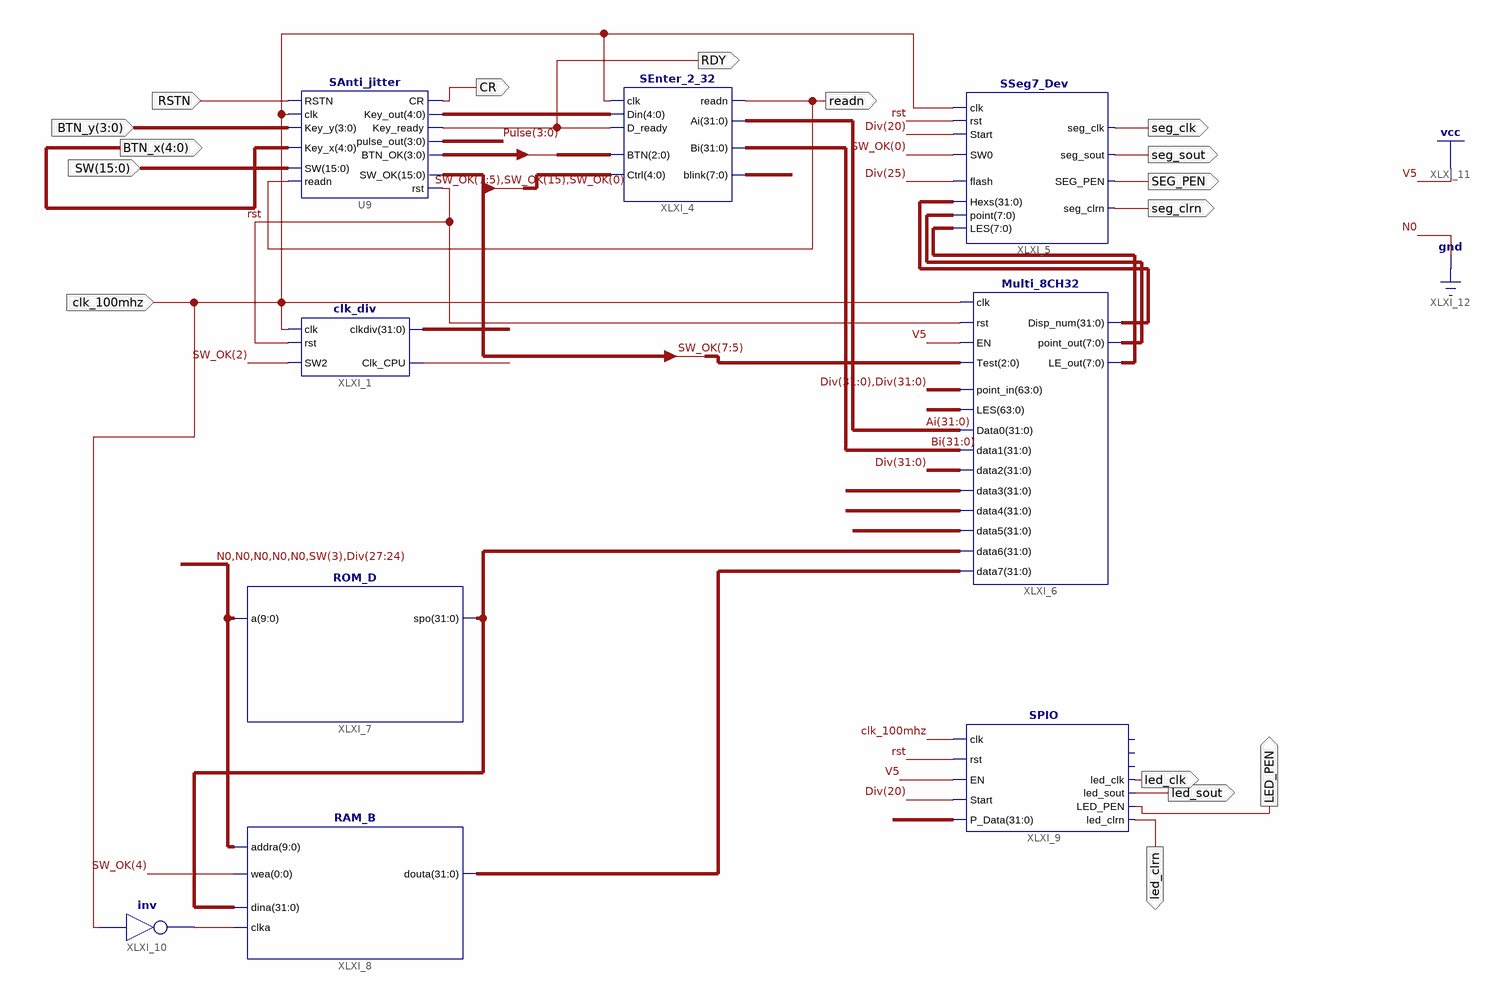
[diagram p0: schematic sheet 1]
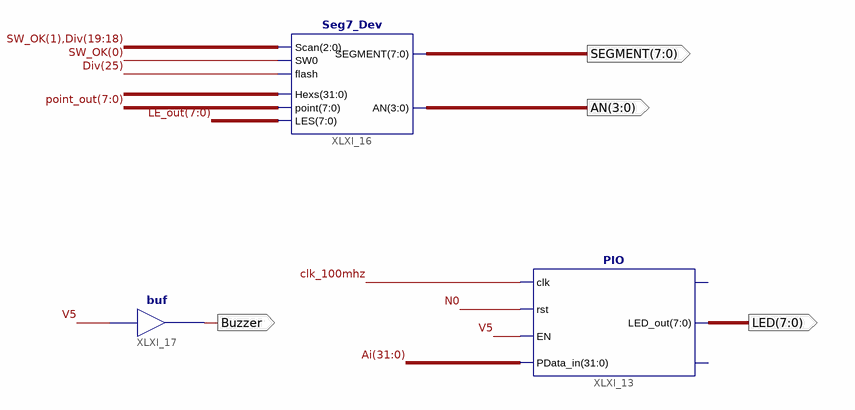
[diagram p1: schematic sheet 2]
// Xilinx ISE schematic Org_Lab1.sch (kintex7) as structural Verilog: 12 symbols, 20 ports
module Org_Lab1 (
  input  RSTN,
  input  [3:0] BTN_y,
  input  [15:0] SW,
  input  clk_100mhz,
  output [4:0] BTN_x,
  output CR,
  output RDY,
  output readn,
  output seg_clk,
  output seg_sout,
  output SEG_PEN,
  output seg_clrn,
  output led_sout,
  output LED_PEN,
  output led_clk,
  output led_clrn,
  output [7:0] SEGMENT,
  output [3:0] AN,
  output [7:0] LED,
  output Buzzer
);

  wire Clk_CPU, rst, XLXN_20;
  wire [3:0] BTN_OK, Pulse;
  wire [4:0] XLXN_6;
  wire [7:0] blink, LE_out, point_out, XLXN_40, XLXN_41;
  wire [15:0] SW_OK;
  wire [31:0] Ai, Bi, CNT, Disp_num, Div, XLXN_39, XLXN_50, XLXN_53, XLXN_74, XLXN_75;

  clk_div XLXI_1 (.rst(rst), .clk(clk_100mhz), .SW2(SW_OK[2]), .clkdiv(Div), .Clk_CPU(Clk_CPU));
  SAnti_jitter U9 (
    .SW(SW), .readn(readn), .Key_y(BTN_y), .Key_x(BTN_x), .RSTN(RSTN), .clk(clk_100mhz), .Key_out(XLXN_6),
    .Key_ready(RDY), .CR(CR), .rst(rst), .SW_OK(SW_OK), .pulse_out(Pulse), .BTN_OK(BTN_OK));
  SEnter_2_32 XLXI_4 (
    .readn(readn), .Ai(Ai), .Bi(Bi), .blink(blink), .Din(XLXN_6), .D_ready(RDY), .clk(clk_100mhz),
    .Ctrl({SW_OK[7:5], SW_OK[15], SW_OK[0]}), .BTN(BTN_OK[2:0]));
  SSeg7_Dev XLXI_5 (
    .LES(XLXN_41), .SEG_PEN(SEG_PEN), .seg_sout(seg_sout), .seg_clrn(seg_clrn), .point(XLXN_40),
    .Hexs(XLXN_39), .SW0(SW_OK[0]), .flash(Div[25]), .seg_clk(seg_clk), .clk(clk_100mhz), .rst(rst),
    .Start(Div[20]));
  Multi_8CH32 XLXI_6 (
    .Test(SW_OK[7:5]), .point_in({Div, Div}), .EN(1'b1), .clk(clk_100mhz), .rst(rst),
    .LES({{12{1'b0}}, blink[3:0], {32{1'b0}}, blink, blink}), .Data0(Ai), .data1(Bi), .data2(Div),
    .data3(CNT), .data4(XLXN_74), .data5(XLXN_75), .data6(XLXN_50), .data7(XLXN_53), .point_out(XLXN_40),
    .LE_out(XLXN_41), .Disp_num(XLXN_39));
  ROM_D XLXI_7 (.a({{5{1'b0}}, SW[3], Div[27:24]}), .spo(XLXN_50));
  RAM_B XLXI_8 (
    .addra({{5{1'b0}}, SW[3], Div[27:24]}), .clka(XLXN_20), .wea(SW_OK[4]), .dina(XLXN_50), .douta(XLXN_53));
  SPIO XLXI_9 (
    .clk(clk_100mhz), .P_Data({SW[13:0], SW_OK, 2'b00}), .rst(rst), .EN(1'b1), .Start(Div[20]),
    .led_clk(led_clk), .led_clrn(led_clrn), .LED_PEN(LED_PEN), .led_sout(led_sout));  // open: GPIOf0, LED_out, counter_set
  not XLXI_10 (XLXN_20, clk_100mhz);
  PIO XLXI_13 (.clk(clk_100mhz), .rst(1'b0), .EN(1'b1), .PData_in(Ai), .LED_out(LED));  // open: GPIOf0, counter_set
  Seg7_Dev XLXI_16 (
    .LES(LE_out), .Scan({SW_OK[1], Div[19:18]}), .SEGMENT(SEGMENT), .AN(AN), .point(point_out),
    .flash(Div[25]), .SW0(SW_OK[0]), .Hexs(Disp_num));
  buf XLXI_17 (Buzzer, 1'b1);
endmodule
